# EAGLE design Xpander3 (EAGLE 5.07)
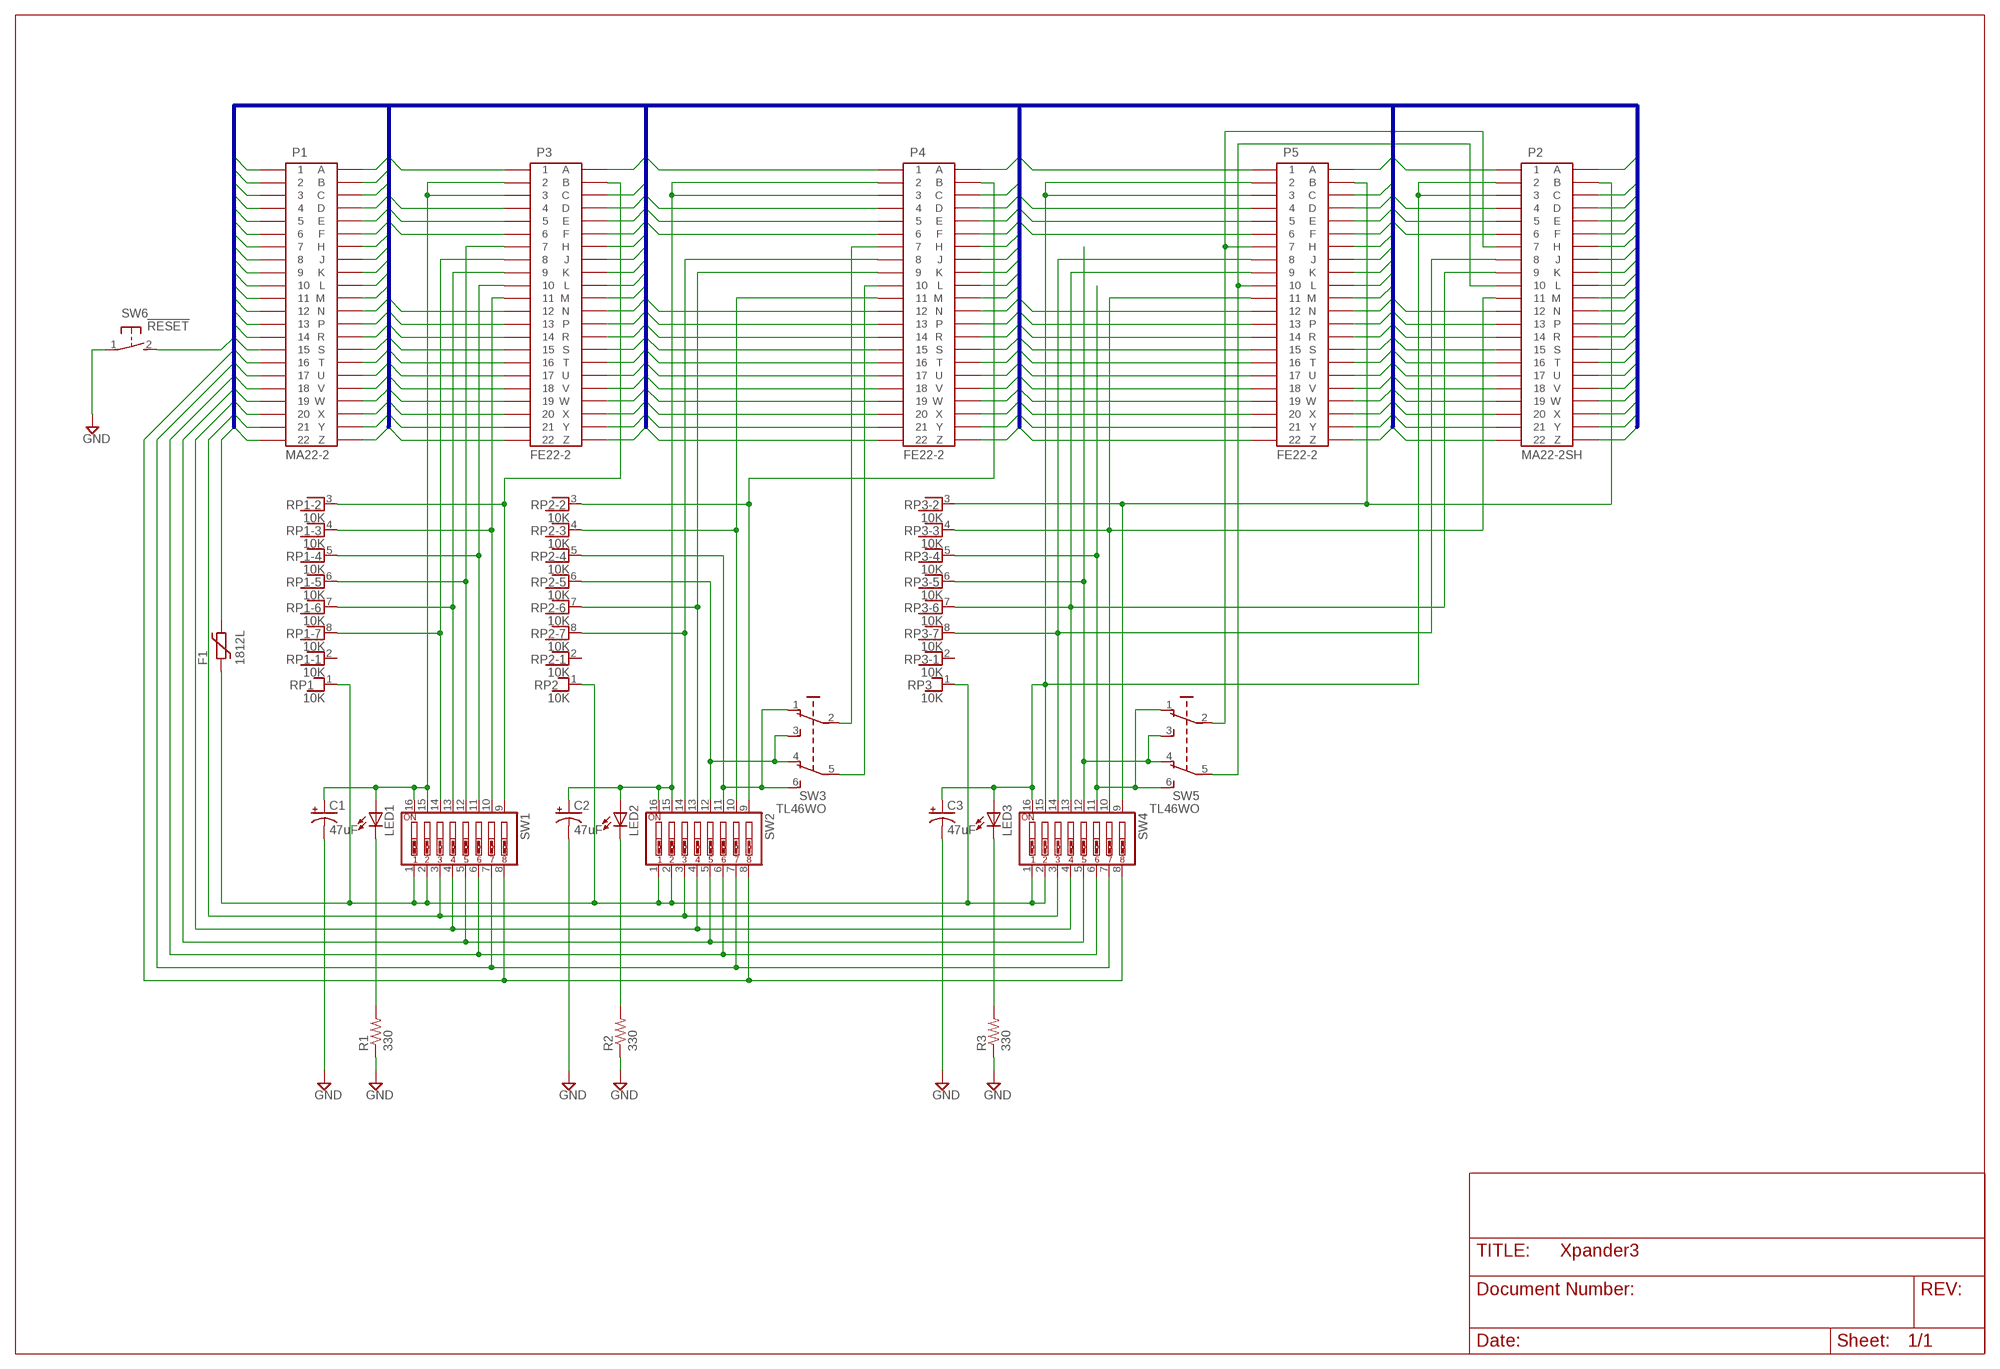
[diagram p0: schematic, sheet 1]

## Parts
C1  47uF  CPOL-USE2,5-6E  [E2,5-6E]
C2  47uF  CPOL-USE2,5-6E  [E2,5-6E]
C3  47uF  CPOL-USE2,5-6E  [E2,5-6E]
F1  1812L  [1812L]
LED1  LED3MM  [LED3MM]
LED2  LED3MM  [LED3MM]
LED3  LED3MM  [LED3MM]
P1  MA22-2  44PINEDGE  [44PINEDGE]
P2  MA22-2SH  [MA22-2_SHORT]
P3  FE22-2  [FE22-2]
P4  FE22-2  [FE22-2]
P5  FE22-2  [FE22-2]
R1  330  R-US_0204/7  [0204/7]
R2  330  R-US_0204/7  [0204/7]
R3  330  R-US_0204/7  [0204/7]
RP1  10K  RNX7  [RN-8]
RP2  10K  RNX7  [RN-8]
RP3  10K  RNX7  [RN-8]
SW1  SW_DIP-8  [EDG-08]
SW2  SW_DIP-8  [EDG-08]
SW3  TL46WO  [TL4XWO]
SW4  SW_DIP-8  [EDG-08]
SW5  TL46WO  [TL4XWO]
SW6  !RESET  31-XX  [B3F-31XX]

## Nets
4: P1.4 P2.4 P3.4 P4.4 P5.4
5: P1.5 P2.5 P3.5 P4.5 P5.5
6: P1.6 P2.6 P3.6 P4.6 P5.6
7: P1.7 SW1.5 SW2.5 SW4.5
8: P1.8 SW1.3 SW2.3 SW4.3
9: P1.9 SW1.4 SW2.4 SW4.4
10: P1.10 SW1.6 SW2.6 SW4.6
11: P1.11 SW1.7 SW2.7 SW4.7
12: P1.12 P2.12 P3.12 P4.12 P5.12
13: P1.13 P2.13 P3.13 P4.13 P5.13
14: P1.14 P2.14 P3.14 P4.14 P5.14
15: P1.15 P2.15 P3.15 P4.15 P5.15
16: P1.16 P2.16 P3.16 P4.16 P5.16
17: P1.17 P2.17 P3.17 P4.17 P5.17
18: P1.18 P2.18 P3.18 P4.18 P5.18
19: P1.19 P2.19 P3.19 P4.19 P5.19
20: P1.20 P2.20 P3.20 P4.20 P5.20
21: P1.21 P2.21 P3.21 P4.21 P5.21
B: P1.B SW1.8 SW2.8 SW4.8
C: P1.C P2.C P3.C P4.C P5.C SW6.2(S)
D: P1.D P2.D P3.D P4.D P5.D
E: P1.E P2.E P3.E P4.E P5.E
F: P1.F P2.F P3.F P4.F P5.F
FVCC: F1.P$1 RP1.1 RP2.1 RP3.1 SW1.1 SW1.2 SW2.1 SW2.2 SW4.1 SW4.2
GND: C1.- C2.- C3.- P1.1 P1.22 P1.A P1.Z P2.1 P2.22 P2.A P2.Z P3.1 P3.22 P3.A P3.Z P4.1 P4.22 P4.A P4.Z P5.1 P5.22 P5.A P5.Z R1.1 R2.1 R3.1 SW6.1(P)
H: P1.H P2.H P3.H P4.H P5.H
J: P1.J P2.J P3.J P4.J P5.J
K: P1.K P2.K P3.K P4.K P5.K
L: P1.L P2.L P3.L P4.L P5.L
M: P1.M P2.M P3.M P4.M P5.M
N: P1.N P2.N P3.N P4.N P5.N
N$1: P3.7 RP1.6 SW1.12
N$2: P3.8 RP1.8 SW1.14
N$3: P3.9 RP1.7 SW1.13
N$4: P3.10 RP1.5 SW1.11
N$5: P3.11 RP1.4 SW1.10
N$6: P3.B RP1.3 SW1.9
N$7: C1.+ LED1.A P3.2 P3.3 SW1.15 SW1.16
N$8: C2.+ LED2.A P4.2 P4.3 SW2.15 SW2.16
N$9: RP2.6 SW2.12 SW3.3(S) SW3.4(O1)
N$10: P4.11 RP2.4 SW2.10
N$12: P4.9 RP2.7 SW2.13
N$13: P4.8 RP2.8 SW2.14
N$15: P4.B RP2.3 SW2.9
N$16: RP2.5 SW2.11 SW3.1(O) SW3.6(S1)
N$17: LED1.K(C) R1.2
N$18: P2.9 P5.9 RP3.7 SW4.13
N$19: P4.10 SW3.5(P1)
N$20: P2.11 P5.11 RP3.4 SW4.10
N$21: P2.B P5.B RP3.3 SW4.9
N$22: C3.+ LED3.A P2.2 P2.3 P5.2 P5.3 SW4.15 SW4.16
N$23: P4.7 SW3.2(P)
N$24: P2.8 P5.8 RP3.8 SW4.14
N$25: LED2.K(C) R2.2
N$26: LED3.K(C) R3.2
N$27: P2.7 P5.7 SW5.2(P)
N$28: P2.10 P5.10 SW5.5(P1)
N$29: RP3.6 SW4.12 SW5.3(S) SW5.4(O1)
N$30: RP3.5 SW4.11 SW5.1(O) SW5.6(S1)
P: P1.P P2.P P3.P P4.P P5.P
R: P1.R P2.R P3.R P4.R P5.R
S: P1.S P2.S P3.S P4.S P5.S
T: P1.T P2.T P3.T P4.T P5.T
U: P1.U P2.U P3.U P4.U P5.U
V: P1.V P2.V P3.V P4.V P5.V
VCC: F1.P$2 P1.2 P1.3
W: P1.W P2.W P3.W P4.W P5.W
X: P1.X P2.X P3.X P4.X P5.X
Y: P1.Y P2.Y P3.Y P4.Y P5.Y
Unconnected: RP1.2 RP2.2 RP3.2

## Buses
GND,VCC,4,5,6,7,8,9,10,11,12,13,14,15,16,17,18,19,20,21,B,C,D,E,F,H,J,K,L,M,N,P,R,S,T,U,V,W,X,Y

## Library data of the parts
C1-C3 = rcl:CPOL-US: POLARIZED CAPACITOR, American symbol
F1 = ptc-littlefuse:1812L
LED1-LED3 = led:LED: LED OSRAM: - CHIPLED LG R971, LG N971, LY N971, LG Q971, LY Q971, LO R971, LY R971 LH N974, LH R974 LS Q976, LO Q976, LY Q976 LO Q996 - Hyper CHIPLED LW Q18S LB Q993, LB Q99A, LB R99A - SideLED LS A670, LO A670, LY A670, LG A670, LP A670 LB A673, LV A673, LT A673, LW A673 LH A674 LY A675 LS A676, LA A676, LO A676, LY A676, LW A676 LS A679, LY A679, LG A679 - Hyper Micro SIDELED® LS Y876, LA Y876, LO Y876, LY Y876 LT Y87S - SmartLED LW L88C, LW L88S LB L89C, LB L89S, LG L890 LS L89K, LO L89K, LY L89K LS L896, LA L896, LO L896, LY L896 - TOPLED LS T670, LO T670, LY T670, LG T670, LP T670 LSG T670, LSP T670, LSY T670, LOP T670, LYG T670 LG T671, LOG T671, LSG T671 LB T673, LV T673, LT T673, LW T673 LH T674 LS T676, LA T676, LO T676, LY T676, LB T676, LH T676, LSB T676, LW T676 LB T67C, LV T67C, LT T67C, LS T67K, LO T67K, LY T67K, LW E67C LS E67B, LA E67B, LO E67B, LY E67B, LB E67C, LV E67C, LT E67C LW T67C LS T679, LY T679, LG T679 LS T770, LO T770, LY T770, LG T770, LP T770 LB T773, LV T773, LT T773, LW T773 LH T774 LS E675, LA E675, LY E675, LS T675 LS T776, LA T776, LO T776, LY T776, LB T776 LHGB T686 LT T68C, LB T68C - Hyper Mini TOPLED® LB M676 - Mini TOPLED Santana® LG M470 LS M47K, LO M47K, LY M47K Source: http://www.osram.convergy.de LUXEON: - LUMILED® LXK2-PW12-R00, LXK2-PW12-S00, LXK2-PW14-U00, LXK2-PW14-V00 LXK2-PM12-R00, LXK2-PM12-S00, LXK2-PM14-U00 LXK2-PE12-Q00, LXK2-PE12-R00, LXK2-PE12-S00, LXK2-PE14-T00, LXK2-PE14-U00 LXK2-PB12-K00, LXK2-PB12-L00, LXK2-PB12-M00, LXK2-PB14-N00, LXK2-PB14-P00, LXK2-PB14-Q00 LXK2-PR12-L00, LXK2-PR12-M00, LXK2-PR14-Q00, LXK2-PR14-R00 LXK2-PD12-Q00, LXK2-PD12-R00, LXK2-PD12-S00 LXK2-PH12-R00, LXK2-PH12-S00 LXK2-PL12-P00, LXK2-PL12-Q00, LXK2-PL12-R00 Source: www.luxeon.com KINGBRIGHT: KA-3528ASYC Source: www.kingbright.com
P1 = con-edge-100:44PINEDGE: 44 PIN EDGE CONNECTOR FOR PCB
P2 = con-edge-100:MA22-2
P3-P5 = con-edge-100:FE22-2
R1-R3 = rcl:R-US_: RESISTOR, American symbol
RP1-RP3 = resistor-net:RNX7: RESISTOR NETWORK
SW1 SW2 SW4 = special:SW_DIP-8: DIP SWITCH
SW3 SW5 = switch:TL46WO: TINY SWITCH ON - ON Source: http://www2.produktinfo.conrad.com/datenblaetter/700000-724999/705152-da-01-de-Subminiaturschalter_TL_36WO.pdf
SW6 = switch-omron:31-XX: OMRON SWITCH

## Board
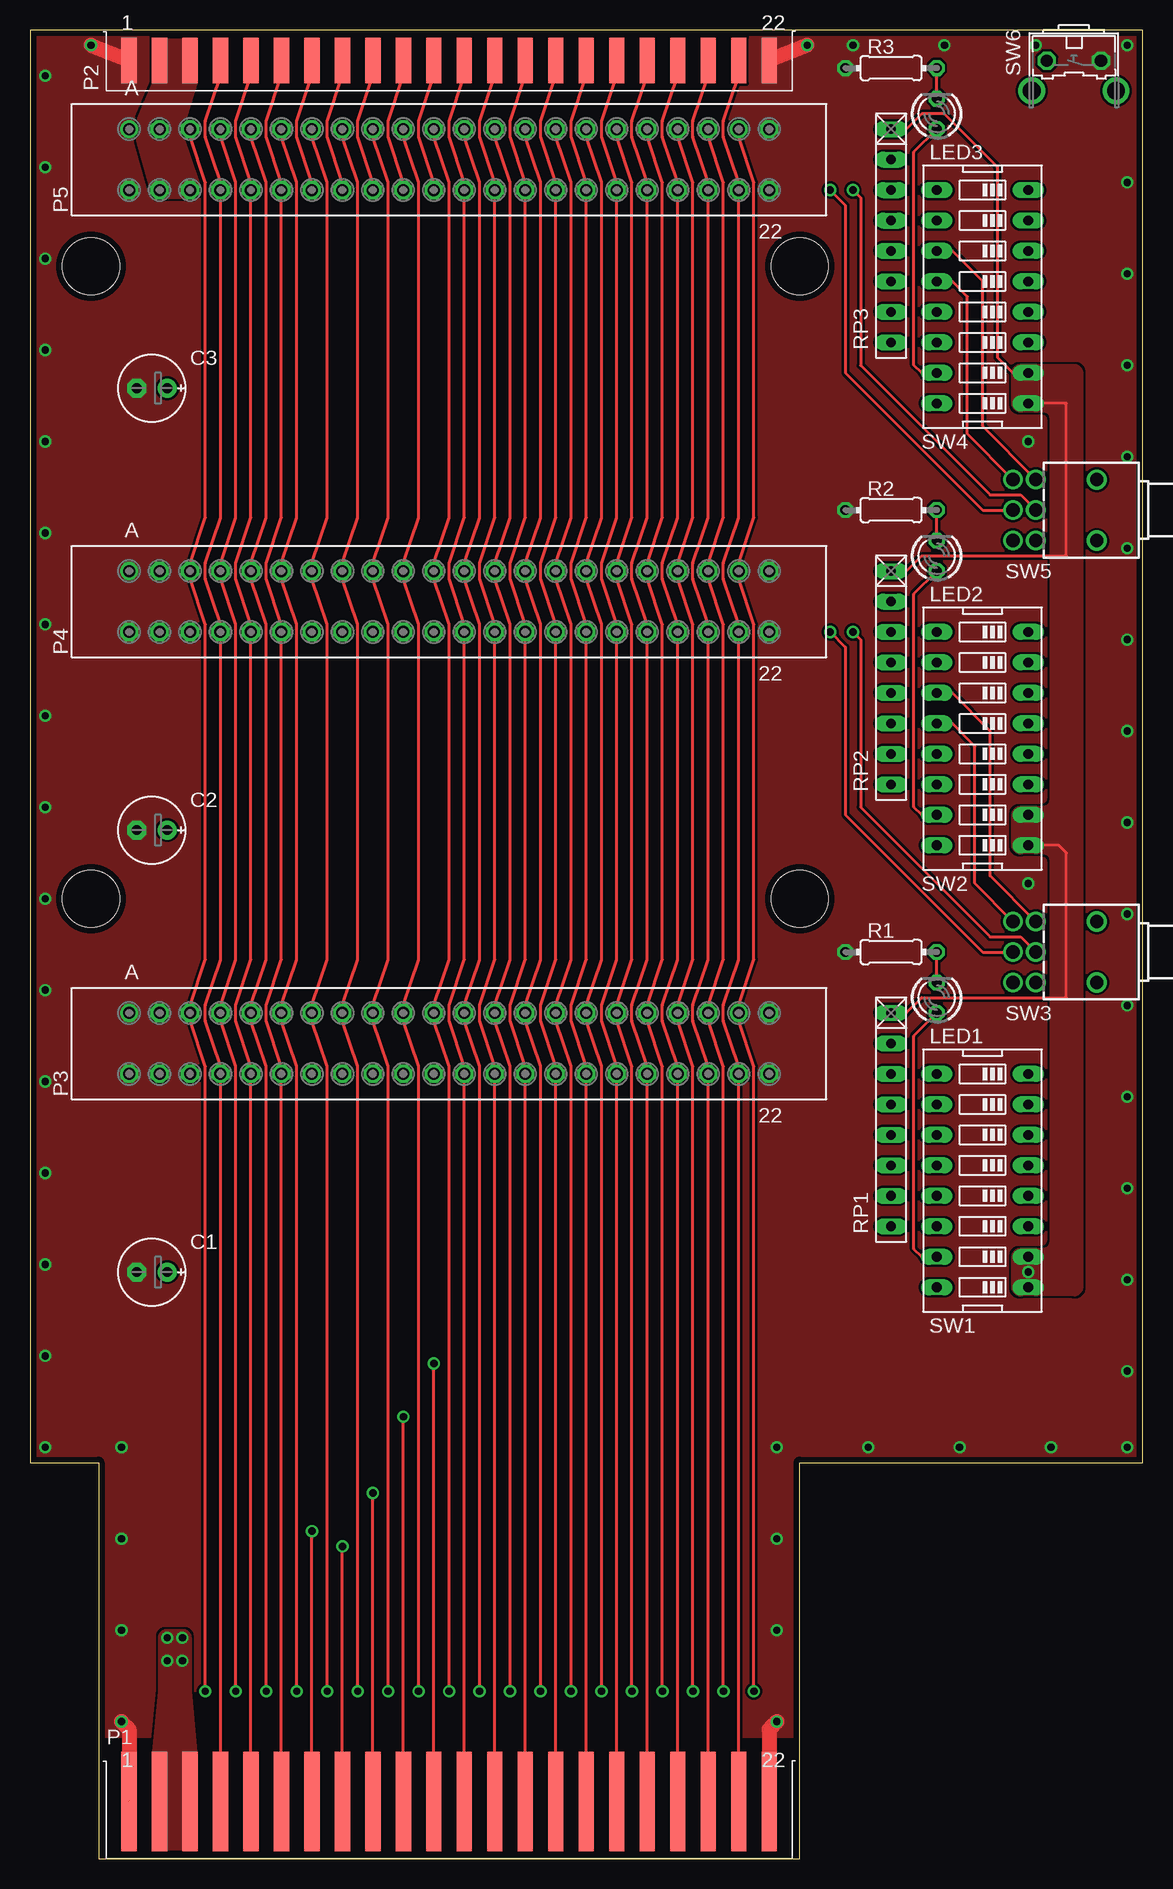
[diagram p1: board, top side]
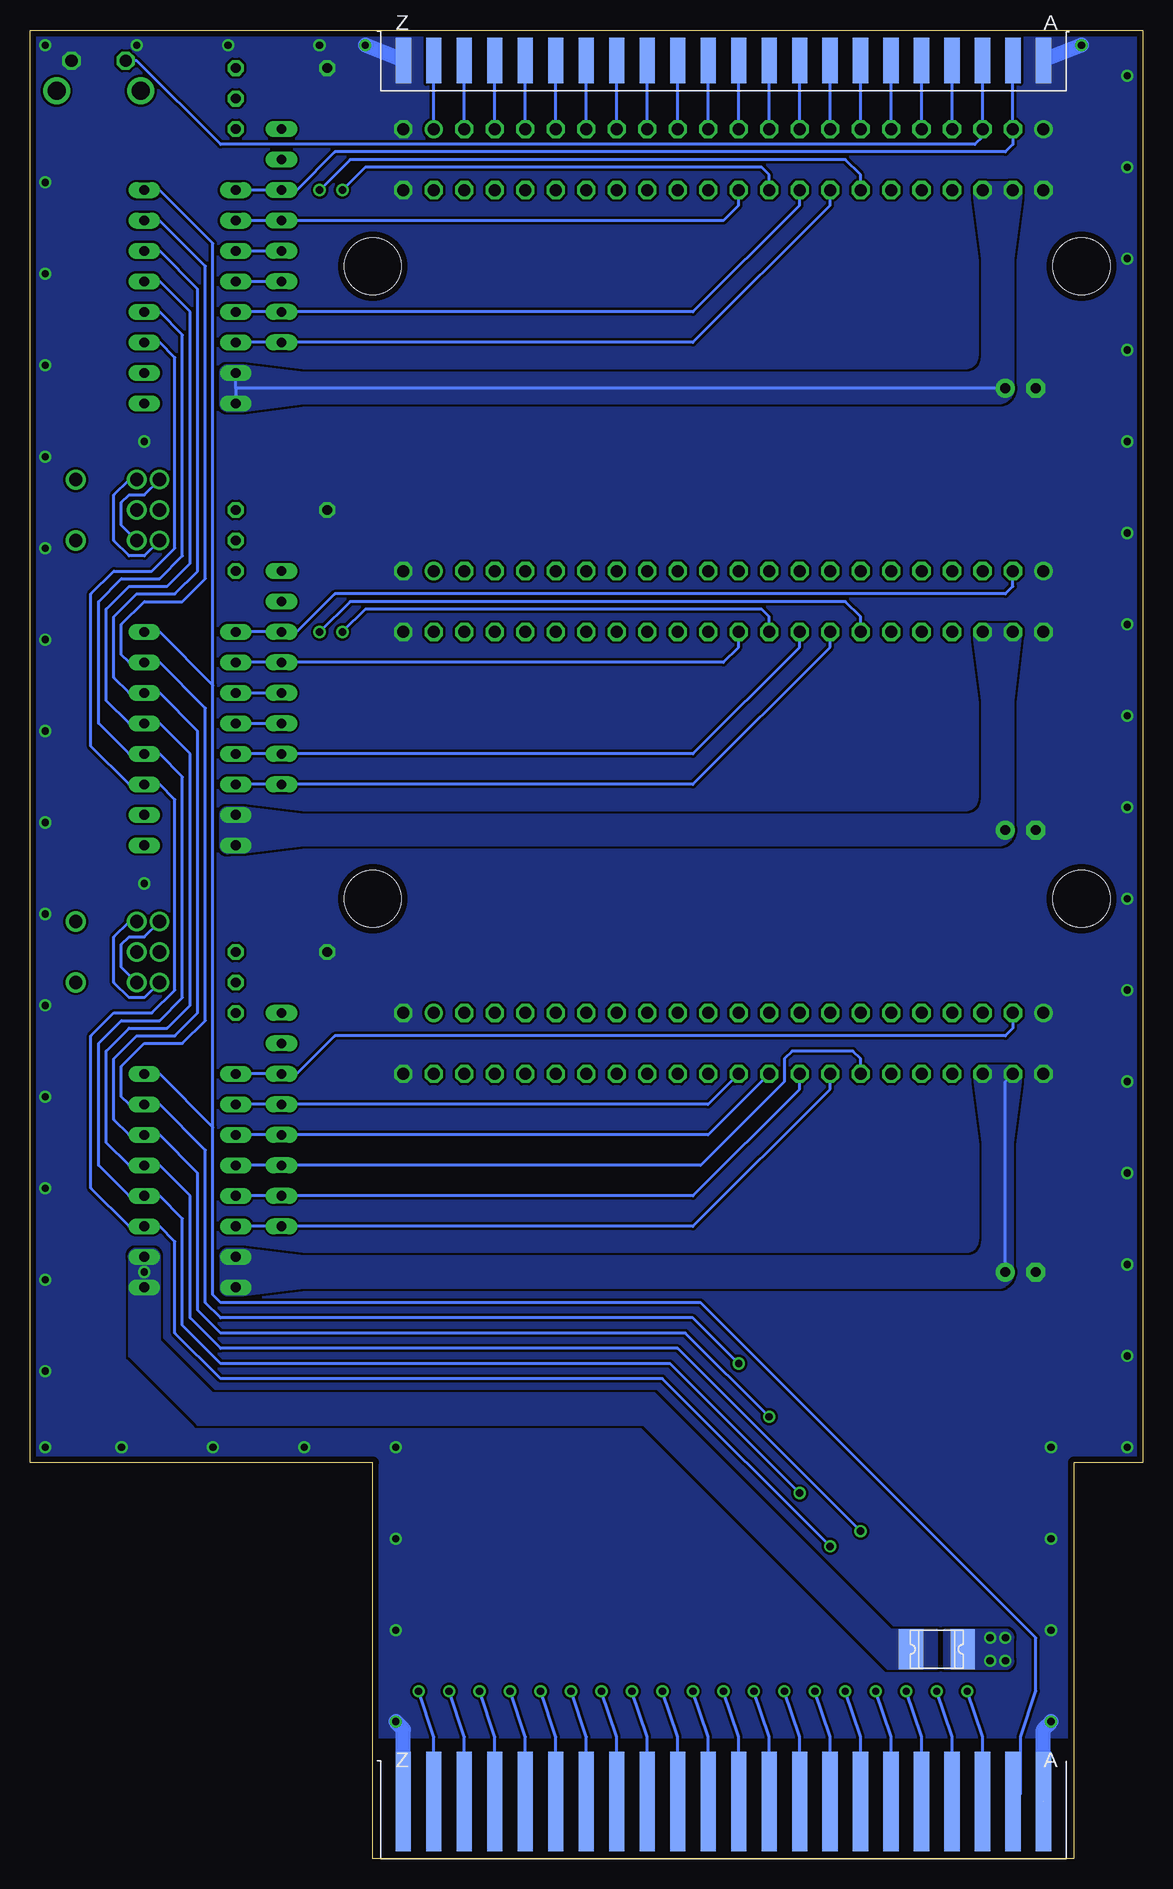
[diagram p2: board, bottom side, seen from below]

Size 92.71 x 152.4 mm. Coordinates in mm from the lower left corner, seen from the top.
Outline: 64.14,0 64.14,33.02 92.71,33.02 92.71,152.4 0,152.4 0,33.02 5.71,33.02 5.71,0 64.14,0
Copper layers (1*16): Top 0.035mm / dielectric 1.5mm / Bottom 0.035mm
Design rules "ourpcb-small *": minimum track width 8mil, minimum drill 12mil, track to track 8mil, track to pad 8mil, pad to pad 8mil, via to via 8mil, smd to smd 0mil, copper to edge 20mil, drill to drill 8mil, minimum pad ring 10mil, minimum via ring 8mil, stop-mask expansion 4mil, vias tented up to drill 0mil, thermal gap 10mil
Holes 4.75 mm at 64.14,80.01 64.14,132.72 5.08,132.72 5.08,80.01

### Footprints (pad centres in the part's own frame; a part is rotated, then mirrored left to right if it is on the bottom)
E2,5-6E = drill 0.813 pad 1.575: + -1.27,0 | drill 0.813 pad 1.575 octagon: - 1.27,0
1812L = smd 2.03 x 3.3: P$1 -2.16,0; P$2 2.16,0
LED3MM = drill 0.813 octagon: A -1.27,0; K 1.27,0
44PINEDGE = smd 1.27 x 8.255: 1 -24.765,-0.305; 2 -22.225,-0.305; 3 -19.685,-0.305; 4 -17.145,-0.305; 5 -14.605,-0.305; 6 -12.065,-0.305; 7 -9.525,-0.305; 8 -6.985,-0.305; 9 -4.445,-0.305; 10 -1.905,-0.305; 11 0.635,-0.305; 12 3.175,-0.305; 13 5.715,-0.305; 14 8.255,-0.305; 15 10.795,-0.305; 16 13.335,-0.305; 17 15.875,-0.305; 18 18.415,-0.305; 19 20.955,-0.305; 20 23.495,-0.305; 21 26.035,-0.305; 22 28.575,-0.305 | smd 1.27 x 8.255 bottom: A -24.765,-0.305; B -22.225,-0.305; C -19.685,-0.305; D -17.145,-0.305; E -14.605,-0.305; F -12.065,-0.305; H -9.525,-0.305; J -6.985,-0.305; K -4.445,-0.305; L -1.905,-0.305; M 0.635,-0.305; N 3.175,-0.305; P 5.715,-0.305; R 8.255,-0.305; S 10.795,-0.305; T 13.335,-0.305; U 15.875,-0.305; V 18.415,-0.305; W 20.955,-0.305; X 23.495,-0.305; Y 26.035,-0.305; Z 28.575,-0.305
MA22-2_SHORT = smd 1.27 x 3.81: 1 -26.67,0; 2 -24.13,0; 3 -21.59,0; 4 -19.05,0; 5 -16.51,0; 6 -13.97,0; 7 -11.43,0; 8 -8.89,0; 9 -6.35,0; 10 -3.81,0; 11 -1.27,0; 12 1.27,0; 13 3.81,0; 14 6.35,0; 15 8.89,0; 16 11.43,0; 17 13.97,0; 18 16.51,0; 19 19.05,0; 20 21.59,0; 21 24.13,0; 22 26.67,0 | smd 1.27 x 3.81 bottom: A -26.67,0; B -24.13,0; C -21.59,0; D -19.05,0; E -16.51,0; F -13.97,0; H -11.43,0; J -8.89,0; K -6.35,0; L -3.81,0; M -1.27,0; N 1.27,0; P 3.81,0; R 6.35,0; S 8.89,0; T 11.43,0; U 13.97,0; V 16.51,0; W 19.05,0; X 21.59,0; Y 24.13,0; Z 26.67,0
FE22-2 = drill 1 octagon: 1 -26.67,-2.54; 2 -24.13,-2.54; 3 -21.59,-2.54; 4 -19.05,-2.54; 5 -16.51,-2.54; 6 -13.97,-2.54; 7 -11.43,-2.54; 8 -8.89,-2.54; 9 -6.35,-2.54; 10 -3.81,-2.54; 11 -1.27,-2.54; 12 1.27,-2.54; 13 3.81,-2.54; 14 6.35,-2.54; 15 8.89,-2.54; 16 11.43,-2.54; 17 13.97,-2.54; 18 16.51,-2.54; 19 19.05,-2.54; 20 21.59,-2.54; 21 24.13,-2.54; 22 26.67,-2.54; B -24.13,2.54; C -21.59,2.54; D -19.05,2.54; E -16.51,2.54; F -13.97,2.54; H -11.43,2.54; J -8.89,2.54; K -6.35,2.54; L -3.81,2.54; M -1.27,2.54; N 1.27,2.54; P 3.81,2.54; R 6.35,2.54; S 8.89,2.54; T 11.43,2.54; U 13.97,2.54; V 16.51,2.54; W 19.05,2.54; X 21.59,2.54; Z 26.67,2.54 | drill 1: A -26.67,2.54; Y 24.13,2.54
0204/7 = drill 0.813 octagon: 1 -3.81,0; 2 3.81,0
RN-8 = drill 0.813 long: 1 -8.89,0; 2 -6.35,0; 3 -3.81,0; 4 -1.27,0; 5 1.27,0; 6 3.81,0; 7 6.35,0; 8 8.89,0
EDG-08 = drill 0.813 long: 1 -8.89,-3.81; 2 -6.35,-3.81; 3 -3.81,-3.81; 4 -1.27,-3.81; 5 1.27,-3.81; 6 3.81,-3.81; 7 6.35,-3.81; 8 8.89,-3.81; 9 8.89,3.81; 10 6.35,3.81; 11 3.81,3.81; 12 1.27,3.81; 13 -1.27,3.81; 14 -3.81,3.81; 15 -6.35,3.81; 16 -8.89,3.81
TL4XWO = drill 1.1 pad 1.422: 1 -2.54,-5.08; 2 0,-5.08; 3 2.54,-5.08; 4 -2.54,-6.985; 5 0,-6.985; 6 2.54,-6.985 | drill 1.1 pad 1.676: M1 -2.54,0; M2 2.54,0
B3F-31XX = drill 1.016 octagon: 1 -2.261,-1.245; 2 2.261,-1.245 | drill 1.499 pad 2.159: 3 -3.505,1.245; 4 3.505,1.245

### Placement (x,y rotation side)
C1  10.16,48.9 180 top
C2  10.16,85.72 180 top
C3  10.16,122.56 180 top
F1  17.14,17.46 0 bottom
LED1  75.56,71.75 90 top
LED2  75.56,108.58 90 top
LED3  75.56,145.41 90 top
P1  33.02,5.08 0 top
P2  34.92,149.86 0 top
P3  34.92,67.94 0 top
P4  34.92,104.78 0 top
P5  34.92,141.6 0 top
R1  71.75,75.56 0 top
R2  71.75,112.39 0 top
R3  71.75,149.22 0 top
RP1  71.75,61.59 270 top
RP2  71.75,98.42 270 top
RP3  71.75,135.25 270 top
SW1  79.38,56.52 90 top
SW2  79.38,93.34 90 top
SW3  88.9,75.56 270 top
SW4  79.38,130.18 90 top
SW5  88.9,112.39 270 top
SW6  87,148.59 180 top

### Tracks (layer width: path | path; a pad name or v marks a point on that pad's centre or on a via)
4
  Top 0.254: P1.4 P3.4 15.88,66.04 14.61,69.85 14.61,71.12 15.88,74.93 P4.4 15.88,102.87 14.61,106.68 14.61,107.95 15.88,111.76 P5.4 15.88,139.7 14.61,143.51 14.61,144.78 15.88,148.59 P2.4
5
  Top 0.254: P1.5 P3.5 18.41,66.04 17.14,69.85 17.14,71.12 18.41,74.93 P4.5 18.41,102.87 17.14,106.68 17.14,107.95 18.41,111.76 P5.5 18.41,139.7 17.14,143.51 17.14,144.78 18.41,148.59 P2.5
6
  Top 0.254: P1.6 P3.6 20.95,66.04 19.68,69.85 19.68,71.12 20.95,74.93 P4.6 20.95,102.87 19.68,106.68 19.68,107.95 20.95,111.76 P5.6 20.95,139.7 19.68,143.51 19.68,144.78 20.95,148.59 P2.6
7  (via drill 0.61)
  Top 0.254: P1.7 v23.5,27.3
  Bottom 0.254: v23.5,27.3 38.73,42.55 76.83,42.55 79.38,45.09 79.38,55.24 81.92,57.78 SW1.5 84.45,57.78 86.36,59.69 86.36,67.31 84.45,69.22 81.28,69.22 79.38,71.12 79.38,92.08 81.92,94.61 SW2.5 84.45,94.61 86.36,96.52 86.36,104.14 84.45,106.05 81.28,106.05 79.38,107.95 79.38,128.91 81.92,131.44 SW4.5
8  (via drill 0.61)
  Top 0.254: P1.8 v26.04,26.04
  Bottom 0.254: v26.04,26.04 40.01,40.01 76.83,40.01 80.64,43.81 80.64,51.44 81.92,52.7 SW1.3 84.45,52.7 87.63,55.88 87.63,68.58 85.72,70.48 82.55,70.48 80.64,72.39 80.64,88.27 81.92,89.53 SW2.3 84.45,89.53 87.63,92.71 87.63,105.41 85.72,107.31 82.55,107.31 80.64,109.22 80.64,125.09 81.92,126.36 SW4.3
9  (via drill 0.61)
  Top 0.254: P1.9 v28.57,30.48
  Bottom 0.254: v28.57,30.48 39.37,41.27 76.83,41.27 80.01,44.45 80.01,53.34 81.92,55.24 SW1.4 84.45,55.24 87,57.78 87,67.94 85.09,69.85 81.92,69.85 80.01,71.75 80.01,90.17 81.92,92.08 SW2.4 84.45,92.08 87,94.61 87,104.78 85.09,106.68 81.92,106.68 80.01,108.58 80.01,127 81.92,128.91 SW4.4
10  (via drill 0.61)
  Top 0.254: P1.10 v31.11,36.83
  Bottom 0.254: v31.11,36.83 38.1,43.81 76.83,43.81 78.74,45.72 78.74,57.15 81.92,60.33 SW1.6 84.45,60.33 85.72,61.59 85.72,66.67 83.82,68.58 80.64,68.58 78.74,70.48 78.74,93.98 81.92,97.16 SW2.6 84.45,97.16 85.72,98.42 85.72,103.5 83.82,105.41 80.64,105.41 78.74,107.31 78.74,130.81 81.92,133.99 SW4.6
11  (via drill 0.61)
  Top 0.254: P1.11 v33.66,41.27
  Bottom 0.254: v33.66,41.27 37.47,45.09 76.83,45.09 78.11,46.35 78.11,59.05 81.92,62.87 SW1.7 84.45,62.87 85.09,63.5 85.09,66.04 83.19,67.94 80.01,67.94 78.11,69.85 78.11,95.89 81.92,99.69 SW2.7 84.45,99.69 85.09,100.33 85.09,102.87 83.19,104.78 80.01,104.78 78.11,106.68 78.11,132.72 81.92,136.53 SW4.7
12
  Top 0.254: P1.12 P3.12 36.2,66.04 34.92,69.85 34.92,71.12 36.2,74.93 P4.12 36.2,102.87 34.92,106.68 34.92,107.95 36.2,111.76 P5.12 36.2,139.7 34.92,143.51 34.92,144.78 36.2,148.59 P2.12
13
  Top 0.254: P1.13 P3.13 38.73,66.04 37.47,69.85 37.47,71.12 38.73,74.93 P4.13 38.73,102.87 37.47,106.68 37.47,107.95 38.73,111.76 P5.13 38.73,139.7 37.47,143.51 37.47,144.78 38.73,148.59 P2.13
14
  Top 0.254: P1.14 P3.14 41.27,66.04 40.01,69.85 40.01,71.12 41.27,74.93 P4.14 41.27,102.87 40.01,106.68 40.01,107.95 41.27,111.76 P5.14 41.27,139.7 40.01,143.51 40.01,144.78 41.27,148.59 P2.14
15
  Top 0.254: P1.15 P3.15 43.81,66.04 42.55,69.85 42.55,71.12 43.81,74.93 P4.15 43.81,102.87 42.55,106.68 42.55,107.95 43.81,111.76 P5.15 43.81,139.7 42.55,143.51 42.55,144.78 43.81,148.59 P2.15
16
  Top 0.254: P1.16 P3.16 46.35,66.04 45.09,69.85 45.09,71.12 46.35,74.93 P4.16 46.35,102.87 45.09,106.68 45.09,107.95 46.35,111.76 P5.16 46.35,139.7 45.09,143.51 45.09,144.78 46.35,148.59 P2.16
17
  Top 0.254: P1.17 P3.17 48.9,66.04 47.62,69.85 47.62,71.12 48.9,74.93 P4.17 48.9,102.87 47.62,106.68 47.62,107.95 48.9,111.76 P5.17 48.9,139.7 47.62,143.51 47.62,144.78 48.9,148.59 P2.17
18
  Top 0.254: P1.18 P3.18 51.44,66.04 50.16,69.85 50.16,71.12 51.44,74.93 P4.18 51.44,102.87 50.16,106.68 50.16,107.95 51.44,111.76 P5.18 51.44,139.7 50.16,143.51 50.16,144.78 51.44,148.59 P2.18
19
  Top 0.254: P1.19 P3.19 53.98,66.04 52.7,69.85 52.7,71.12 53.98,74.93 P4.19 53.98,102.87 52.7,106.68 52.7,107.95 53.98,111.76 P5.19 53.98,139.7 52.7,143.51 52.7,144.78 53.98,148.59 P2.19
20
  Top 0.254: P1.20 P3.20 56.52,66.04 55.24,69.85 55.24,71.12 56.52,74.93 P4.20 56.52,102.87 55.24,106.68 55.24,107.95 56.52,111.76 P5.20 56.52,139.7 55.24,143.51 55.24,144.78 56.52,148.59 P2.20
21
  Top 0.254: P1.21 P3.21 59.05,66.04 57.78,69.85 57.78,71.12 59.05,74.93 P4.21 59.05,102.87 57.78,106.68 57.78,107.95 59.05,111.76 P5.21 59.05,139.7 57.78,143.51 57.78,144.78 59.05,148.59 P2.21
B
  Bottom 0.254: P1.B 10.16,5.41 10.16,10.16 8.89,13.97 8.89,18.41 36.83,46.35 76.83,46.35 77.47,46.99 77.47,60.96 | SW1.8 81.92,65.41 77.47,60.96 | SW2.8 81.92,102.23 77.47,97.79 | 77.47,60.96 77.47,97.79 | SW4.8 81.92,139.06 77.47,134.62 77.47,97.79
C  (via drill 0.61)
  Top 0.254: v14.61,13.97 14.61,66.04 13.34,69.85 P3.C 13.34,71.12 14.61,74.93 14.61,102.87 13.34,106.68 P4.C 13.34,107.95 14.61,111.76 14.61,139.7 13.34,143.51 P5.C
  Bottom 0.254: P1.C 13.34,10.16 v14.61,13.97 | SW6.2 83.8,149.84 76.83,142.88 13.97,142.88 13.34,143.51 P5.C P2.C
D  (via drill 0.61)
  Top 0.254: v17.14,13.97 17.14,66.04 15.88,69.85 P3.D 15.88,71.12 17.14,74.93 17.14,102.87 15.88,106.68 P4.D 15.88,107.95 17.14,111.76 17.14,139.7 15.88,143.51 P5.D
  Bottom 0.254: P1.D 15.88,10.16 v17.14,13.97 | P5.D P2.D
E  (via drill 0.61)
  Top 0.254: v19.68,13.97 19.68,66.04 18.41,69.85 P3.E 18.41,71.12 19.68,74.93 19.68,102.87 18.41,106.68 P4.E 18.41,107.95 19.68,111.76 19.68,139.7 18.41,143.51 P5.E
  Bottom 0.254: P1.E 18.41,10.16 v19.68,13.97 | P5.E P2.E
F  (via drill 0.61)
  Top 0.254: v22.23,13.97 22.23,66.04 20.95,69.85 P3.F 20.95,71.12 22.23,74.93 22.23,102.87 20.95,106.68 P4.F 20.95,107.95 22.23,111.76 22.23,139.7 20.95,143.51 P5.F
  Bottom 0.254: P1.F 20.95,10.16 v22.23,13.97 | P5.F P2.F
FVCC  (via drill 0.61)
  Top 0.254: RP1.1 73.03,70.48 74.3,71.75 86.36,71.75 86.36,83.82 85.72,84.45 SW2.1 | RP2.1 73.03,107.31 74.3,108.58 86.36,108.58 86.36,121.28 SW4.1 | RP3.1 73.03,144.15 74.3,145.41 76.2,145.41 80.64,140.97 80.64,125.09 81.92,123.83 SW4.2
  other vias: 83.19,48.9
  pour Bottom (no thermals): 17.14,19.05 20.95,19.05 40.64,38.73 77.47,38.73 81.92,43.18 81.92,50.16 arc-90 82.55,50.8 83.82,50.8 arc-90 84.45,50.16 84.45,41.91 78.74,36.2 41.59,36.2 21.27,15.88 17.14,15.88
  pour Top (no thermals): 82.55,46.99 arc-90 81.92,47.62 81.92,50.16 arc-90 82.55,50.8 84.45,50.8 arc90 85.09,51.44 85.09,83.19 arc90 84.45,83.82 82.55,83.82 arc-90 81.92,84.45 81.92,87 arc-90 82.55,87.63 84.45,87.63 arc90 85.09,88.27 85.09,120.02 arc90 84.45,120.65 82.55,120.65 arc-90 81.92,121.28 81.92,123.83 arc-90 82.55,124.46 87,124.46 arc-90 87.63,123.83 87.63,47.62 arc-90 87,46.99
GND  (via drill 0.61)  (1 unrouted)
  Top 1.27: v5.08,151.13 P2.A | v64.77,151.13 P2.Z | v62.23,11.43 61.59,10.79 P1.Z | v7.62,11.43 8.26,10.79 8.26,5.08
  Bottom 1.27: v5.08,151.13 P2.A | P2.Z v64.77,151.13 | P1.Z 61.59,10.79 v62.23,11.43 | P1.1 8.26,10.79 v7.62,11.43
  other vias: 85.09,34.29 91.44,40.64 77.47,34.29 69.85,34.29 91.44,34.29 62.23,19.05 62.23,26.67 62.23,34.29 91.44,48.26 91.44,55.88 91.44,63.5 91.44,71.12 91.44,78.74 91.44,86.36 91.44,93.98 91.44,101.6 91.44,109.22 91.44,116.84 91.44,124.46 91.44,132.08 91.44,139.7 83.82,151.13 76.2,151.13 1.27,34.29 1.27,41.91 1.27,49.53 1.27,57.15 1.27,64.77 1.27,72.39 1.27,80.01 1.27,87.63 1.27,95.25 1.27,102.87 1.27,110.49 1.27,118.11 1.27,125.73 1.27,133.35 1.27,140.97 1.27,148.59 68.58,151.13 7.62,34.29 7.62,26.67 7.62,19.05 83.19,118.11 83.19,81.28 91.44,151.13
  pour Bottom (rank 2, no thermals): 64.14,10.16 5.71,10.16 5.71,33.02 0,33.02 0,152.4 92.71,152.4 92.71,33.02 64.14,33.02
  pour Top (rank 2, no thermals): 0,33.02 0,152.4 92.71,152.4 92.71,33.02 64.14,33.02 64.14,10.16 5.71,10.16 5.71,33.02
H  (via drill 0.61)
  Top 0.254: v24.77,13.97 24.77,66.04 23.5,69.85 P3.H 23.5,71.12 24.77,74.93 24.77,102.87 23.5,106.68 P4.H 23.5,107.95 24.77,111.76 24.77,139.7 23.5,143.51 P5.H
  Bottom 0.254: P1.H 23.5,10.16 v24.77,13.97 | P5.H P2.H
J  (via drill 0.61)
  Top 0.254: v27.3,13.97 27.3,66.04 26.04,69.85 P3.J 26.04,71.12 27.3,74.93 27.3,102.87 26.04,106.68 P4.J 26.04,107.95 27.3,111.76 27.3,139.7 26.04,143.51 P5.J
  Bottom 0.254: P1.J 26.04,10.16 v27.3,13.97 | P5.J P2.J
K  (via drill 0.61)
  Top 0.254: v29.84,13.97 29.84,66.04 28.57,69.85 P3.K 28.57,71.12 29.84,74.93 29.84,102.87 28.57,106.68 P4.K 28.57,107.95 29.84,111.76 29.84,139.7 28.57,143.51 P5.K
  Bottom 0.254: P1.K 28.57,10.16 v29.84,13.97 | P5.K P2.K
L  (via drill 0.61)
  Top 0.254: v32.38,13.97 32.38,66.04 31.11,69.85 P3.L 31.11,71.12 32.38,74.93 32.38,102.87 31.11,106.68 P4.L 31.11,107.95 32.38,111.76 32.38,139.7 31.11,143.51 P5.L
  Bottom 0.254: P1.L 31.11,10.16 v32.38,13.97 | P5.L P2.L
M  (via drill 0.61)
  Top 0.254: v34.92,13.97 34.92,66.04 33.66,69.85 P3.M 33.66,71.12 34.92,74.93 34.92,102.87 33.66,106.68 P4.M 33.66,107.95 34.92,111.76 34.92,139.7 33.66,143.51 P5.M
  Bottom 0.254: P1.M 33.66,10.16 v34.92,13.97 | P5.M P2.M
N  (via drill 0.61)
  Top 0.254: v37.47,13.97 37.47,66.04 36.2,69.85 P3.N 36.2,71.12 37.47,74.93 37.47,102.87 36.2,106.68 P4.N 36.2,107.95 37.47,111.76 37.47,139.7 36.2,143.51 P5.N
  Bottom 0.254: P1.N 36.2,10.16 v37.47,13.97 | P5.N P2.N
N$1
  Bottom 0.254: SW1.12 RP1.6 36.83,57.78 29.84,64.77 29.84,66.67 29.21,67.31 24.13,67.31 23.5,66.67 P3.7
N$2
  Bottom 0.254: SW1.14 RP1.8 37.47,52.7 26.04,64.14 P3.8
N$3
  Bottom 0.254: SW1.13 RP1.7 37.47,55.24 28.57,64.14 P3.9
N$4
  Bottom 0.254: SW1.11 RP1.5 36.2,60.33 P3.10
N$5
  Bottom 0.254: SW1.10 RP1.4 36.2,62.87 P3.11
N$6
  Bottom 0.254: P3.B 10.79,69.22 11.43,68.58 67.31,68.58 70.48,65.41 RP1.3 SW1.9
N$7
  Top 0.254: SW1.15 74.3,50.16 73.66,50.8 73.66,68.58 LED1.A
  Bottom 0.254: C1.+ 11.43,64.77 P3.2
  pour Bottom (no thermals): 10.16,65.41 arc-90 10.79,66.04 13.34,66.04 arc-90 13.97,65.41 13.97,64.77 13.34,59.69 13.34,51.44 arc90 14.61,50.16 69.85,50.16 74.93,50.8 76.2,50.8 arc-90 76.83,50.16 76.83,47.62 arc-90 76.2,46.99 74.93,46.99 69.85,47.62 12.06,47.62 arc-90 10.79,48.9 10.79,59.69 10.16,64.77
N$8
  Top 0.254: SW2.15 74.3,87 73.66,87.63 73.66,105.41 LED2.A
  pour Bottom (no thermals): 10.16,102.23 10.79,96.52 10.79,85.72 arc90 12.06,84.45 69.85,84.45 74.93,83.82 76.2,83.82 arc90 76.83,84.45 76.83,87 arc90 76.2,87.63 74.93,87.63 69.85,87 14.61,87 arc-90 13.34,88.27 13.34,96.52 13.97,101.6 13.97,102.23 arc90 13.34,102.87 10.79,102.87 arc90
N$9
  Top 0.254: SW2.12 76.83,94.61 78.74,92.71 78.74,81.28 SW3.4
  Bottom 0.254: SW2.12 RP2.6 | SW3.3 85.09,74.3 85.09,76.2 84.45,76.83 83.19,76.83 SW3.4
N$10
  Bottom 0.254: SW2.10 RP2.4 34.92,99.69 33.66,100.97 P4.11
N$12
  Bottom 0.254: SW2.13 RP2.7 37.47,92.08 28.57,100.97 P4.9
N$13
  Bottom 0.254: SW2.14 RP2.8 37.47,89.53 26.04,100.97 P4.8
N$15
  Bottom 0.254: SW2.9 RP2.3 70.48,102.23 67.31,105.41 11.43,105.41 10.79,106.05 P4.B
N$16
  Top 0.254: SW2.11 76.83,97.16 80.01,93.98 80.01,81.92 SW3.1
  Bottom 0.254: SW2.11 RP2.5 | SW3.6 83.19,71.75 84.45,71.75 85.72,73.03 85.72,76.83 84.45,78.11 SW3.1
N$17
  Top 0.254: LED1.K R1.2
N$18
  Top 0.254: P5.9 28.57,139.7 27.3,143.51 27.3,144.78 28.57,148.59 P2.9
  Bottom 0.254: P5.9 28.57,137.79 37.47,128.91 RP3.7 SW4.13
N$19  (via drill 0.61)
  Top 0.254: SW3.5 79.38,75.56 67.94,87 67.94,100.97 v66.67,102.23
  Bottom 0.254: P4.10 31.11,103.5 31.75,104.14 64.77,104.14 v66.67,102.23
N$20
  Top 0.254: P5.11 33.66,139.7 32.38,143.51 32.38,144.78 33.66,148.59 P2.11
  Bottom 0.254: P5.11 33.66,137.79 34.92,136.53 RP3.4 SW4.10
N$21
  Bottom 0.254: SW4.9 RP3.3 70.48,139.06 67.31,142.24 11.43,142.24 10.79,142.88 P5.B P2.B
N$22
  Top 0.254: SW4.15 74.3,123.83 73.66,124.46 73.66,142.24 LED3.A
  Top 0.61: 10.79,148.59 P2.2
  Bottom 0.254: C3.+ 75.56,122.56 | 75.56,122.56 SW4.15 | 75.56,122.56 SW4.16
  pour Bottom (no thermals): 10.16,139.06 10.16,138.43 10.79,133.35 10.79,122.56 arc90 12.06,121.28 69.85,121.28 74.93,120.65 76.2,120.65 arc90 76.83,121.28 76.83,123.83 arc90 76.2,124.46 74.93,124.46 69.85,123.83 14.61,123.83 arc-90 13.34,125.09 13.34,133.35 13.97,138.43 13.97,139.06 arc90 13.34,139.7 10.79,139.7 arc90
  pour Top (no thermals): 10.32,151.61 13.81,151.61 13.81,147.96 12.7,144.3 12.7,143.51 13.97,139.7 13.97,139.06 arc-90 13.34,138.43 10.79,138.43 arc-90 10.16,139.06 8.89,143.51 8.89,144.62 10.32,147.96
N$23  (via drill 0.61)
  Top 0.254: SW3.2 82.55,76.83 80.01,76.83 69.22,87.63 69.22,101.6 v68.58,102.23
  Bottom 0.254: P4.7 23.5,103.5 24.77,104.78 66.04,104.78 v68.58,102.23
N$24
  Top 0.254: P5.8 26.04,139.7 24.77,143.51 24.77,144.78 26.04,148.59 P2.8
  Bottom 0.254: P5.8 26.04,137.79 37.47,126.36 RP3.8 SW4.14
N$25
  Top 0.254: LED2.K R2.2
N$26
  Top 0.254: LED3.K R3.2
N$27  (via drill 0.61)
  Top 0.254: SW5.2 82.55,113.67 80.01,113.67 69.22,124.46 69.22,138.43 v68.58,139.06 | P5.7 23.5,139.7 22.23,143.51 22.23,144.78 23.5,148.59 P2.7
  Bottom 0.254: P5.7 23.5,140.34 24.77,141.6 66.04,141.6 v68.58,139.06
N$28  (via drill 0.61)
  Top 0.254: SW5.5 79.38,112.39 67.94,123.83 67.94,137.79 v66.67,139.06 | P5.10 31.11,139.7 29.84,143.51 29.84,144.78 31.11,148.59 P2.10
  Bottom 0.254: 31.11,138.43 P5.10 31.11,140.34 31.75,140.97 64.77,140.97 v66.67,139.06
N$29
  Top 0.254: SW4.12 76.83,131.44 78.11,130.18 78.11,118.75 SW5.4
  Bottom 0.254: SW4.12 RP3.6 | SW5.3 85.09,111.12 85.09,113.03 84.45,113.67 83.19,113.67 SW5.4
N$30
  Top 0.254: SW4.11 76.83,133.99 79.38,131.44 79.38,119.38 SW5.1
  Bottom 0.254: SW4.11 RP3.5 | SW5.6 83.19,108.58 84.45,108.58 85.72,109.86 85.72,113.67 84.45,114.94 SW5.1
P  (via drill 0.61)
  Top 0.254: v40.01,13.97 40.01,66.04 38.73,69.85 P3.P 38.73,71.12 40.01,74.93 40.01,102.87 38.73,106.68 P4.P 38.73,107.95 40.01,111.76 40.01,139.7 38.73,143.51 P5.P
  Bottom 0.254: P1.P 38.73,10.16 v40.01,13.97 | P5.P P2.P
R  (via drill 0.61)
  Top 0.254: v42.55,13.97 42.55,66.04 41.27,69.85 P3.R 41.27,71.12 42.55,74.93 42.55,102.87 41.27,106.68 P4.R 41.27,107.95 42.55,111.76 42.55,139.7 41.27,143.51 P5.R
  Bottom 0.254: P1.R 41.27,10.16 v42.55,13.97 | P5.R P2.R
S  (via drill 0.61)
  Top 0.254: v45.09,13.97 45.09,66.04 43.81,69.85 P3.S 43.81,71.12 45.09,74.93 45.09,102.87 43.81,106.68 P4.S 43.81,107.95 45.09,111.76 45.09,139.7 43.81,143.51 P5.S
  Bottom 0.254: P1.S 43.81,10.16 v45.09,13.97 | P5.S P2.S
T  (via drill 0.61)
  Top 0.254: v47.62,13.97 47.62,66.04 46.35,69.85 P3.T 46.35,71.12 47.62,74.93 47.62,102.87 46.35,106.68 P4.T 46.35,107.95 47.62,111.76 47.62,139.7 46.35,143.51 P5.T
  Bottom 0.254: P1.T 46.35,10.16 v47.62,13.97 | P5.T P2.T
U  (via drill 0.61)
  Top 0.254: v50.16,13.97 50.16,66.04 48.9,69.85 P3.U 48.9,71.12 50.16,74.93 50.16,102.87 48.9,106.68 P4.U 48.9,107.95 50.16,111.76 50.16,139.7 48.9,143.51 P5.U
  Bottom 0.254: P1.U 48.9,10.16 v50.16,13.97 | P5.U P2.U
V  (via drill 0.61)
  Top 0.254: v52.7,13.97 52.7,66.04 51.44,69.85 P3.V 51.44,71.12 52.7,74.93 52.7,102.87 51.44,106.68 P4.V 51.44,107.95 52.7,111.76 52.7,139.7 51.44,143.51 P5.V
  Bottom 0.254: P1.V 51.44,10.16 v52.7,13.97 | P5.V P2.V
VCC  (via drill 0.61)
  other vias: 12.7,18.41 11.43,16.51 11.43,18.41 12.7,16.51
  pour Top (no thermals): 10.32,0.79 10.32,8.89 10.79,13.97 10.79,18.41 arc-90 11.43,19.05 12.7,19.05 arc-90 13.34,18.41 13.34,13.97 13.81,8.89 13.81,0.79
  pour Bottom (no thermals): 16.51,15.88 11.43,15.88 arc-90 10.79,16.51 10.79,18.41 arc-90 11.43,19.05 16.51,19.05
W  (via drill 0.61)
  Top 0.254: v55.24,13.97 55.24,66.04 53.98,69.85 P3.W 53.98,71.12 55.24,74.93 55.24,102.87 53.98,106.68 P4.W 53.98,107.95 55.24,111.76 55.24,139.7 53.98,143.51 P5.W
  Bottom 0.254: P1.W 53.98,10.16 v55.24,13.97 | P5.W P2.W
X  (via drill 0.61)
  Top 0.254: v57.78,13.97 57.78,66.04 56.52,69.85 P3.X 56.52,71.12 57.78,74.93 57.78,102.87 56.52,106.68 P4.X 56.52,107.95 57.78,111.76 57.78,139.7 56.52,143.51 P5.X
  Bottom 0.254: P1.X 56.52,10.16 v57.78,13.97 | P5.X P2.X
Y  (via drill 0.61)
  Top 0.254: v60.33,13.97 60.33,66.04 59.05,69.85 P3.Y 59.05,71.12 60.33,74.93 60.33,102.87 59.05,106.68 P4.Y 59.05,107.95 60.33,111.76 60.33,139.7 59.05,143.51 P5.Y
  Bottom 0.254: P1.Y 59.05,10.16 v60.33,13.97 | P5.Y P2.Y

### Text on the board
tValues: ROMH | ROML | IO2 | IO1 | EXROM | GAME | POWER | POWER | NORM | SWAP | NORM | IO1/IO2 | SWAP | ROMH | ROML | IO2 | IO1 | EXROM | GAME | POWER | POWER | NORM | SWAP | NORM | IO1/IO2 | SWAP | ROMH | ROML | IO2 | IO1 | EXROM | GAME | POWER | POWER | C:/Documents and Settings/brain/Desktop/title.bmp